# EAGLE schematic Breakout (EAGLE 7.4.0)
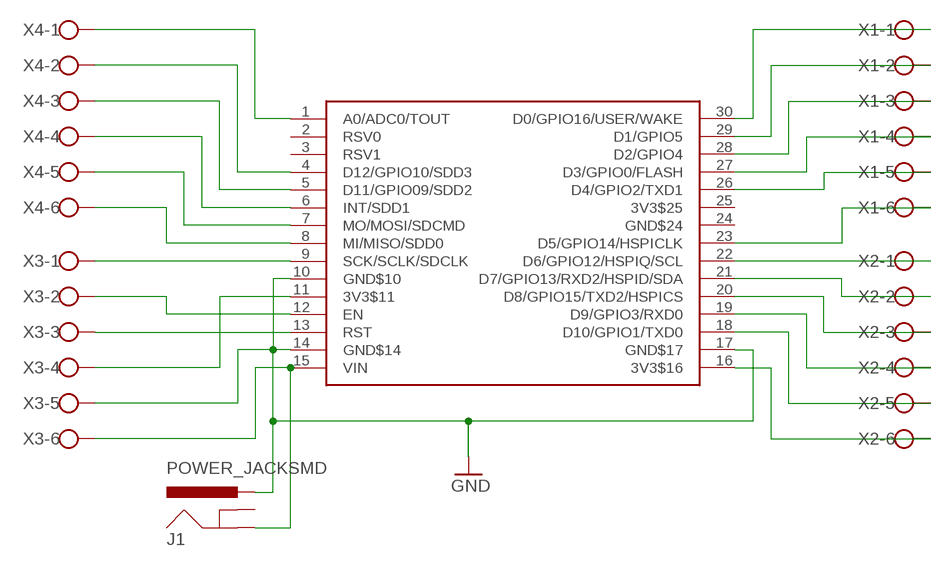
[diagram p0: schematic, sheet 1]

## Parts
J1  POWER_JACKSMD  [POWER_JACK_SMD]
U$1  NERDSHIELD  [NERDUINO_STACK]
X1  W237-6  [W237-6]
X2  W237-6  [W237-6]
X3  W237-6  [W237-6]
X4  W237-6  [W237-6]

## Nets
GND: J1.VIN0(PWR) U$1.10(GND$10) U$1.14(GND$14) U$1.17(GND$17) X3.5
N$1: U$1.16(3V3$16) X2.6
N$2: U$1.18(D10/GPIO1/TXD0) X2.5
N$3: U$1.19(D9/GPIO3/RXD0) X2.4
N$4: U$1.20(D8/GPIO15/TXD2/HSPICS) X2.3
N$5: U$1.21(D7/GPIO13/RXD2/HSPID/SDA) X2.2
N$6: U$1.22(D6/GPIO12/HSPIQ/SCL) X2.1
N$7: U$1.23(D5/GPIO14/HSPICLK) X1.6
N$8: U$1.26(D4/GPIO2/TXD1) X1.5
N$9: U$1.27(D3/GPIO0/FLASH) X1.4
N$10: U$1.28(D2/GPIO4) X1.3
N$11: U$1.29(D1/GPIO5) X1.2
N$12: U$1.30(D0/GPIO16/USER/WAKE) X1.1
N$13: U$1.1(A0/ADC0/TOUT) X4.1
N$14: U$1.4(D12/GPIO10/SDD3) X4.2
N$15: U$1.5(D11/GPIO09/SDD2) X4.3
N$16: U$1.6(INT/SDD1) X4.4
N$17: U$1.7(MO/MOSI/SDCMD) X4.5
N$18: U$1.8(MI/MISO/SDD0) X4.6
N$19: U$1.9(SCK/SCLK/SDCLK) X3.1
N$20: U$1.12(EN) X3.2
N$21: J1.P$4(GND) U$1.15(VIN) X3.6
N$23: U$1.11(3V3$11) X3.4
N$26: U$1.13(RST) X3.3
Unconnected: J1.GND(GNDBREAK) U$1.2(RSV0) U$1.3(RSV1) U$1.24(GND$24) U$1.25(3V3$25)

## Library data of the parts
J1 = SparkFun:POWER_JACK: Power Jack This is the standard 5.5mm barrel jack for power. The PTH is the most common, proven, reliable, footprint. All others are experimental. The Slot footprint only works if the mill layer is transmitted to the PCB fab house so be warned. Spark Fun Electronics SKU : PRT-00119. Mating wall wart : TOL-00298 (and others)
U$1 = NerduinoShieldLib:NERDSHIELD
X1-X4 = con-wago-500:W237-6: WAGO SCREW CLAMP; OC_FARNELL: unknown; OC_NEWARK: unknown